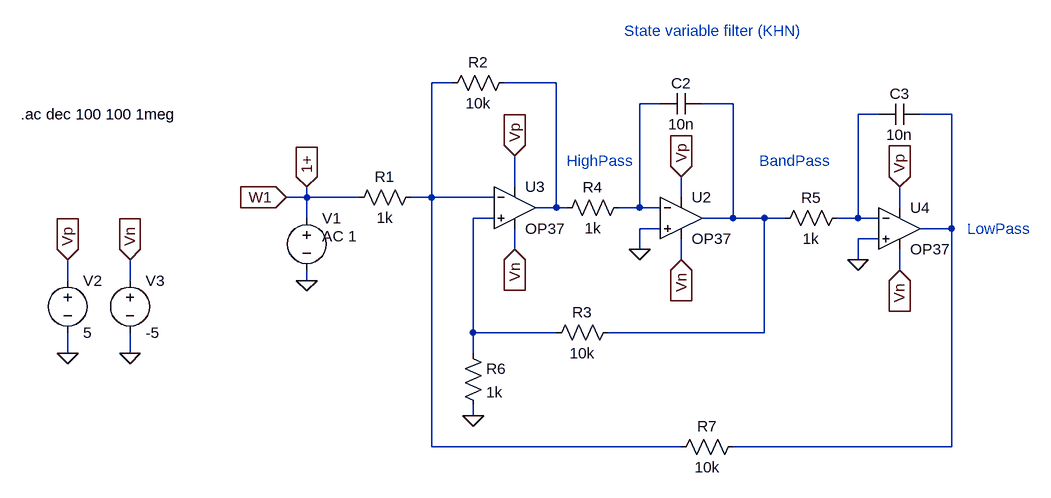
[diagram p0: schematic svf_khn.asc]
svf_khn.asc, the LTspice schematic file:
Version 4
SHEET 1 1136 1244
WIRE 224 416 192 416
WIRE 384 416 304 416
WIRE 544 448 512 448
WIRE 656 448 608 448
WIRE 880 464 848 464
WIRE 992 464 944 464
WIRE 320 576 320 528
WIRE 0 592 0 576
WIRE 0 592 -32 592
WIRE 80 592 0 592
WIRE 192 592 192 416
WIRE 192 592 160 592
WIRE 288 592 192 592
WIRE 576 592 576 560
WIRE 384 608 384 416
WIRE 384 608 352 608
WIRE 400 608 384 608
WIRE 512 608 512 448
WIRE 512 608 480 608
WIRE 544 608 512 608
WIRE 912 608 912 576
WIRE 0 624 0 592
WIRE 288 624 256 624
WIRE 656 624 656 448
WIRE 656 624 608 624
WIRE 704 624 656 624
WIRE 736 624 704 624
WIRE 848 624 848 464
WIRE 848 624 816 624
WIRE 880 624 848 624
WIRE 544 640 512 640
WIRE 992 640 992 464
WIRE 992 640 944 640
WIRE 880 656 848 656
WIRE 320 672 320 640
WIRE 512 672 512 640
WIRE 576 688 576 656
WIRE 848 688 848 656
WIRE 912 704 912 672
WIRE -368 720 -368 688
WIRE -272 720 -272 688
WIRE 0 720 0 704
WIRE 256 800 256 624
WIRE 384 800 256 800
WIRE 704 800 704 624
WIRE 704 800 464 800
WIRE -368 832 -368 800
WIRE -272 832 -272 800
WIRE 256 832 256 800
WIRE 256 928 256 912
WIRE 192 976 192 592
WIRE 576 976 192 976
WIRE 992 976 992 640
WIRE 992 976 656 976
FLAG 0 720 0
FLAG -32 592 W1
IOPIN -32 592 In
FLAG 0 576 1+
IOPIN 0 576 In
FLAG -368 832 0
FLAG -272 832 0
FLAG -368 688 Vp
IOPIN -368 688 In
FLAG -272 688 Vn
IOPIN -272 688 In
FLAG 512 672 0
FLAG 576 560 Vp
IOPIN 576 560 In
FLAG 576 688 Vn
IOPIN 576 688 In
FLAG 320 528 Vp
IOPIN 320 528 In
FLAG 320 672 Vn
IOPIN 320 672 In
FLAG 848 688 0
FLAG 912 576 Vp
IOPIN 912 576 In
FLAG 912 704 Vn
IOPIN 912 704 In
FLAG 256 928 0
SYMBOL voltage 0 608 R0
WINDOW 123 24 44 Left 2
WINDOW 39 0 0 Left 0
SYMATTR Value2 AC 1
SYMATTR InstName V1
SYMATTR Value ""
SYMBOL voltage -368 704 R0
WINDOW 123 0 0 Left 0
WINDOW 39 0 0 Left 0
SYMATTR InstName V2
SYMATTR Value 5
SYMBOL voltage -272 704 R0
WINDOW 123 0 0 Left 0
WINDOW 39 0 0 Left 0
SYMATTR InstName V3
SYMATTR Value -5
SYMBOL Opamps\\OP37 576 560 R0
SYMATTR InstName U2
SYMBOL res 496 592 R90
WINDOW 0 0 56 VBottom 2
WINDOW 3 32 56 VTop 2
SYMATTR InstName R4
SYMATTR Value 1k
SYMBOL cap 608 432 R90
WINDOW 0 0 32 VBottom 2
WINDOW 3 32 32 VTop 2
SYMATTR InstName C2
SYMATTR Value 10n
SYMBOL res 176 576 R90
WINDOW 0 0 56 VBottom 2
WINDOW 3 32 56 VTop 2
SYMATTR InstName R1
SYMATTR Value 1k
SYMBOL res 320 400 R90
WINDOW 0 0 56 VBottom 2
WINDOW 3 32 56 VTop 2
SYMATTR InstName R2
SYMATTR Value 10k
SYMBOL Opamps\\OP37 320 544 R0
SYMATTR InstName U3
SYMBOL Opamps\\OP37 912 576 R0
SYMATTR InstName U4
SYMBOL res 832 608 R90
WINDOW 0 0 56 VBottom 2
WINDOW 3 32 56 VTop 2
SYMATTR InstName R5
SYMATTR Value 1k
SYMBOL cap 944 448 R90
WINDOW 0 0 32 VBottom 2
WINDOW 3 32 32 VTop 2
SYMATTR InstName C3
SYMATTR Value 10n
SYMBOL res 480 784 R90
WINDOW 0 0 56 VBottom 2
WINDOW 3 32 56 VTop 2
SYMATTR InstName R3
SYMATTR Value 10k
SYMBOL res 240 816 R0
SYMATTR InstName R6
SYMATTR Value 1k
SYMBOL res 672 960 R90
WINDOW 0 0 56 VBottom 2
WINDOW 3 32 56 VTop 2
SYMATTR InstName R7
SYMATTR Value 10k
TEXT -440 464 Left 2 !.ac dec 100 100 1meg
TEXT 488 336 Left 2 ;State variable filter (KHN)
TEXT 696 536 Left 2 ;BandPass
TEXT 400 536 Left 2 ;HighPass
TEXT 1016 640 Left 2 ;LowPass

The netlist it stands for:
* svf_khn.asc
V1 1+ 0 AC 1
V2 Vp 0 5
V3 Vn 0 -5
XU2 0 N003 Vp Vn N004 LT1037  ; OP37, pins In+ In- V+ V- OUT
R4 N003 N002 1k
C2 N004 N003 10n
R1 N001 1+ 1k
R2 N002 N001 10k
XU3 N007 N001 Vp Vn N002 LT1037  ; OP37, pins In+ In- V+ V- OUT
XU4 0 N005 Vp Vn N006 LT1037  ; OP37, pins In+ In- V+ V- OUT
R5 N005 N004 1k
C3 N006 N005 10n
R3 N004 N007 10k
R6 N007 0 1k
R7 N006 N001 10k
.ac dec 100 100 1meg
* State variable filter (KHN)
* BandPass
* HighPass
* LowPass
.lib LTC.lib
.backanno
.end